# Altium schematic sheet Sheet_Power.SchDoc
size A4
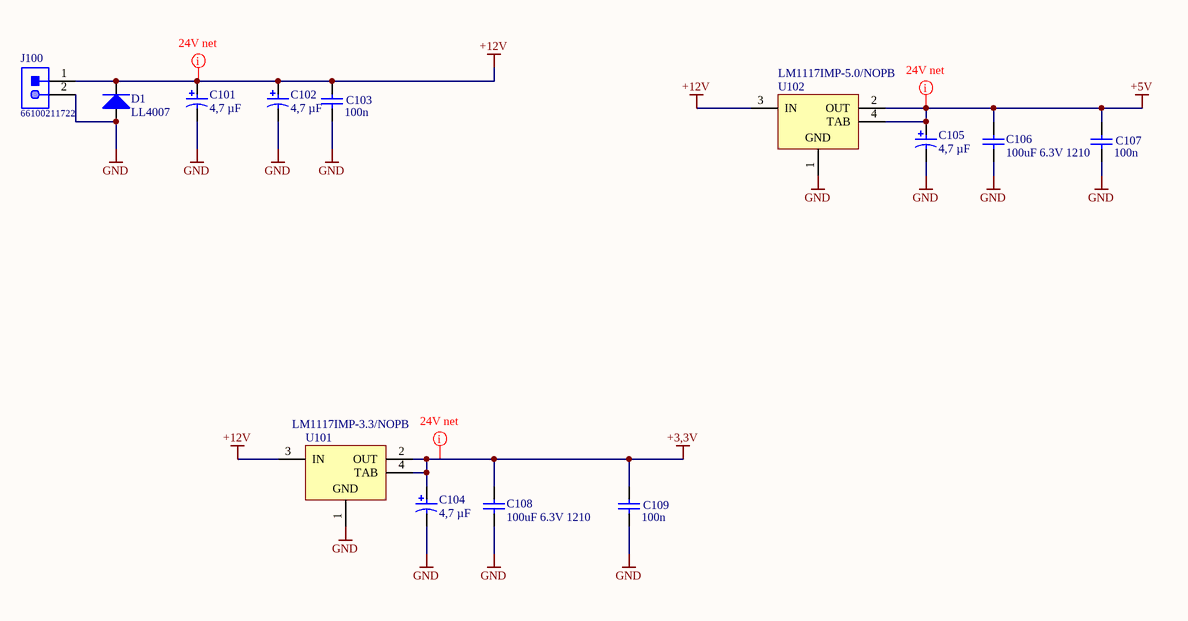
[diagram p0: Sheet_Power.SchDoc]

## Parts
C101  4,7 µF  [A Package]
C102  4,7 µF  [A Package]
C103  100n  [CAPC2013X88X50ML20T25]
C104  4,7 µF  [A Package]
C105  4,7 µF  [A Package]
C106  100uF 6.3V 1210  [885012109004-Footprint-1]
C107  100n  [CAPC2013X88X50ML20T25]
C108  100uF 6.3V 1210  [885012109004-Footprint-1]
C109  100n  [CAPC2013X88X50ML20T25]
D1  LL4007  [LL4007]
J100  66100211722  [66100211722]
U101  LM1117IMP-3.3/NOPB  [DCY0004A_N]
U102  LM1117IMP-5.0/NOPB  [DCY0004A_M]

## Nets
+3,3V: C104.1 C108.2 C109.2 U101.2(OUT) U101.4(TAB)
+5V: C105.1 C106.2 C107.2 U102.2(OUT) U102.4(TAB)
+12V: C101.1 C102.1 C103.2 D1.2(K) J100.1 U101.3(IN) U102.3(IN)
GND: C101.2 C102.2 C103.1 C104.2 C105.2 C106.1 C107.1 C108.1 C109.1 D1.1(A) J100.2 U101.1(GND) U102.1(GND)

## Layout directives
net class 24V_net: +3,3V, +5V, +12V

## Library data of the parts
C101 C102 C104 C105 = CMP-001-0039-3: 4,7 µF; 6V; Gr. A; T491A475K006AT; Manufacturer: KEMET; Capacitance: 4.7µF; ESR (Equivalent Series Resistance): 6 Ohm; Lifetime @ Temp.: 2000 Hrs @ 85°C; Tolerance: ±10%; Type: Molded; Voltage - Rated: 6.3V; ComponentLink1Description: KEM_T2005_T491.pdf; ComponentLink1URL: http://www.kemet.com/Lists/ProductCatalog/Attachments/254/KEM_T2005_T491.pdf; Failure Rate: -; Features: General Purpose; Height - Seated (Max): 0.071" (1.80mm); Lead Spacing: -; Manufacturer Size Code: A; Mounting Type: Surface Mount; Operating Temperature: -55°C ~ 125°C; Package / Case: 1206 (3216 Metric); Packaging: Cut Tape (CT); Part Status: Active; Size / Dimension: 0.126" L x 0.063" W (3.20mm x 1.60mm); Supplier: Digi-Key; Supplier Part Number: 399-9717-1-ND; PartNumber: T491A475K006AT
C103 C107 C109 = CMP-001-0082-2: generic 0805 COG oder X7R Vielschichtkondensatoren max. +/-10%
C106 C108 = CMP-001-0186-3: Ceramic Capacitor, Ceramic, 100uF, 6.3V; PartNumber: 885012109004; REACH SVHC: Yes; Dielectric Material: Ceramic; Capacitor Type: Ceramic; Number of Pins: 2; RoHS Compliant: Yes
D1 = CMP-001-0049-2: LL4007;  Vf 1,1V @ 1A, If = 1A; Manufacturer: TAIWAN SEMICONDUCTOR; PartNumber: LL4007G L2; Bauform - Diode: DO-213; Betriebstemperatur, max.: 175; Diodenkonfiguration: Einfach; Durchlassspannung Vf max.: 1.1; Durchlassstrom (mittlerer) If(AV): 1; Spitzendurchlassstrom Ifsm, max.: 25; SVHC: No SVHC (20-Jun-2016; Verpackung: Gurtabschnitt; Anzahl der Pins: -; ComponentLink1Description: 2182652.pdf; ComponentLink1URL: http://www.farnell.com/datasheets/2182652.pdf; Periodische Sperrspannung Vrrm, max.: 1; Produktpalette: -; Sperrerholzeit Trr, max.: -; Supplier: Farnell; Supplier Part Number: 2677381
J100 = CMP-00524-A.1: Intercom Male Shrouded Locking Header WR-WTB, THT, Right Angled, pitch 2.54 mm, 1 x 2 position; Manufacturer: Wurth Elektronik; Pitch: 2.54mm; Working Voltage: 50VAC; Contact Resistance: 20mOhm; Position: 1x2; Gender: Male; Manufacturer URL: http://www.we-online.de; Operating Temperature: -40to125degC; Packaging: Box; Package Reference: 66100211722; Part Number: 66100211722; Mounting Technology: THT; Datasheet URL: https://katalog.we-online.de/em/datasheet/6610xx11722.pdf; Orientation: RightAngled; Publisher: WurthElektronik
U101 = CMP-00484-1: 800mA Low-Dropout Linear Regulator, 4-pin SOT-223, Pb-Free; Manufacturer: Texas Instruments; PackageTopMarking: XYTT*N05B; PowerWise: N; High-Reliability: Y; CompType: LDO IC; Code_IPC: SOT223-4; PackageReference: DCY0004A; PinCount: 4; PackageDescription: Molded SOT-223, 6.50 x 3.56 x 1.6mm Body, 4 Lead, 2.3mm Pitch; PartNumber: LM1117IMP-3.3/NOPB; RoHS: Y; ComponentLink1Description: Datasheet URL; Code_JEDEC: TO-261-AA; ComponentLink1URL: http://www.ti.com/general/docs/lit/getliterature.tsp?genericPartNumber=LM1117-N&fileType=pdf
U102 = CMP-00485-1: 800mA Low-Dropout Linear Regulator, 4-pin SOT-223, Pb-Free; Manufacturer: Texas Instruments; PackageTopMarking: XYTT*N06B; CompType: LDO IC; PowerWise: N; High-Reliability: Y; RoHS: Y; Code_JEDEC: TO-261-AA; ComponentLink1URL: http://www.ti.com/general/docs/lit/getliterature.tsp?genericPartNumber=LM1117-N&fileType=pdf; Code_IPC: SOT223-4; ComponentLink1Description: Datasheet URL; PartNumber: LM1117IMP-5.0/NOPB; PackageReference: DCY0004A; PinCount: 4; PackageDescription: Molded SOT-223, 6.50 x 3.56 x 1.6mm Body, 4 Lead, 2.3mm Pitch